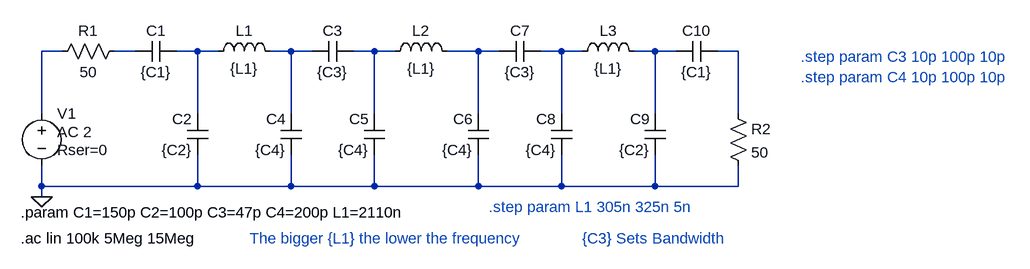
[diagram p0: schematic BandPass10M_1.3.asc]
BandPass10M_1.3.asc, the LTspice schematic file:
Version 4
SHEET 1 880 680
WIRE -848 -192 -880 -192
WIRE -736 -192 -768 -192
WIRE -640 -192 -672 -192
WIRE -608 -192 -640 -192
WIRE -496 -192 -528 -192
WIRE -464 -192 -496 -192
WIRE -368 -192 -400 -192
WIRE -336 -192 -368 -192
WIRE -208 -192 -256 -192
WIRE -176 -192 -208 -192
WIRE -80 -192 -112 -192
WIRE -48 -192 -80 -192
WIRE 64 -192 32 -192
WIRE 96 -192 64 -192
WIRE 192 -192 160 -192
WIRE -880 -96 -880 -192
WIRE -640 -96 -640 -192
WIRE -496 -96 -496 -192
WIRE -368 -96 -368 -192
WIRE -208 -96 -208 -192
WIRE -80 -96 -80 -192
WIRE 64 -96 64 -192
WIRE 192 -96 192 -192
WIRE -880 16 -880 -16
WIRE -640 16 -640 -32
WIRE -640 16 -880 16
WIRE -496 16 -496 -32
WIRE -496 16 -640 16
WIRE -368 16 -368 -32
WIRE -368 16 -496 16
WIRE -208 16 -208 -32
WIRE -208 16 -368 16
WIRE -80 16 -80 -32
WIRE -80 16 -208 16
WIRE 64 16 64 -32
WIRE 64 16 -80 16
WIRE 192 16 192 -16
WIRE 192 16 64 16
WIRE -880 32 -880 16
FLAG -880 32 0
SYMBOL ind -624 -176 R270
WINDOW 0 32 56 VTop 2
WINDOW 3 5 56 VBottom 2
SYMATTR InstName L1
SYMATTR Value {L1}
SYMBOL voltage -880 -112 R0
WINDOW 3 24 44 Left 2
WINDOW 123 24 44 Left 2
WINDOW 39 24 72 Left 2
SYMATTR Value ""
SYMATTR Value2 AC 2
SYMATTR SpiceLine Rser=0
SYMATTR InstName V1
SYMBOL cap -672 -208 R90
WINDOW 0 0 32 VBottom 2
WINDOW 3 32 32 VTop 2
SYMATTR InstName C1
SYMATTR Value {C1}
SYMBOL res -864 -176 R270
WINDOW 0 32 56 VTop 2
WINDOW 3 0 56 VBottom 2
SYMATTR InstName R1
SYMATTR Value 50
SYMBOL cap -624 -32 R180
WINDOW 0 24 56 Left 2
WINDOW 3 24 8 Left 2
SYMATTR InstName C2
SYMATTR Value {C2}
SYMBOL cap -400 -208 R90
WINDOW 0 0 32 VBottom 2
WINDOW 3 32 32 VTop 2
SYMATTR InstName C3
SYMATTR Value {C3}
SYMBOL cap -480 -32 R180
WINDOW 0 24 56 Left 2
WINDOW 3 24 8 Left 2
SYMATTR InstName C4
SYMATTR Value {C4}
SYMBOL ind -352 -176 R270
WINDOW 0 32 56 VTop 2
WINDOW 3 5 56 VBottom 2
SYMATTR InstName L2
SYMATTR Value {L1}
SYMBOL cap -352 -32 R180
WINDOW 0 24 56 Left 2
WINDOW 3 24 8 Left 2
SYMATTR InstName C5
SYMATTR Value {C4}
SYMBOL cap -192 -32 R180
WINDOW 0 24 56 Left 2
WINDOW 3 24 8 Left 2
SYMATTR InstName C6
SYMATTR Value {C4}
SYMBOL cap -112 -208 R90
WINDOW 0 0 32 VBottom 2
WINDOW 3 32 32 VTop 2
SYMATTR InstName C7
SYMATTR Value {C3}
SYMBOL ind -64 -176 R270
WINDOW 0 32 56 VTop 2
WINDOW 3 5 56 VBottom 2
SYMATTR InstName L3
SYMATTR Value {L1}
SYMBOL cap -64 -32 R180
WINDOW 0 24 56 Left 2
WINDOW 3 24 8 Left 2
SYMATTR InstName C8
SYMATTR Value {C4}
SYMBOL cap 80 -32 R180
WINDOW 0 24 56 Left 2
WINDOW 3 24 8 Left 2
SYMATTR InstName C9
SYMATTR Value {C2}
SYMBOL cap 160 -208 R90
WINDOW 0 0 32 VBottom 2
WINDOW 3 32 32 VTop 2
SYMATTR InstName C10
SYMATTR Value {C1}
SYMBOL res 176 -112 R0
SYMATTR InstName R2
SYMATTR Value 50
TEXT -912 96 Left 2 !.ac lin 100k 5Meg 15Meg
TEXT -912 56 Left 2 !.param C1=150p C2=100p C3=47p C4=200p L1=2110n
TEXT -192 48 Left 2 ;.step param L1 305n 325n 5n
TEXT -48 96 Left 2 ;{C3} Sets Bandwidth
TEXT -560 96 Left 2 ;The bigger {L1} the lower the frequency
TEXT 288 -184 Left 2 ;.step param C3 10p 100p 10p
TEXT 288 -152 Left 2 ;.step param C4 10p 100p 10p

The netlist it stands for:
* BandPass10M_1.3.asc
L1 N003 N004 {L1}
V1 N001 0 AC 2 Rser=0
C1 N003 N002 {C1}
R1 N001 N002 50
C2 0 N003 {C2}
C3 N005 N004 {C3}
C4 0 N004 {C4}
L2 N005 N006 {L1}
C5 0 N005 {C4}
C6 0 N006 {C4}
C7 N007 N006 {C3}
L3 N007 N008 {L1}
C8 0 N007 {C4}
C9 0 N008 {C2}
C10 N009 N008 {C1}
R2 N009 0 50
.ac lin 100k 5Meg 15Meg
.param C1=150p C2=100p C3=47p C4=200p L1=2110n
* .step param L1 305n 325n 5n
* {C3} Sets Bandwidth
* The bigger {L1} the lower the frequency
* .step param C3 10p 100p 10p
* .step param C4 10p 100p 10p
.backanno
.end